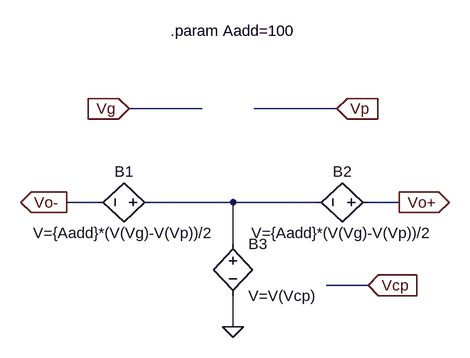
[diagram p0: schematic gain_boosting_pmos.asc]
gain_boosting_pmos.asc, the LTspice schematic file:
Version 4
SHEET 1 880 680
WIRE 128 48 16 48
WIRE 336 48 208 48
WIRE -32 192 -80 192
WIRE 176 192 48 192
WIRE 304 192 176 192
WIRE 432 192 384 192
WIRE 176 256 176 192
WIRE 384 320 320 320
WIRE 176 384 176 336
FLAG 176 384 0
FLAG 384 320 Vcp
IOPIN 384 320 In
FLAG 16 48 Vg
IOPIN 16 48 In
FLAG 336 48 Vp
IOPIN 336 48 In
FLAG -80 192 Vo-
IOPIN -80 192 Out
FLAG 432 192 Vo+
IOPIN 432 192 Out
DATAFLAG 272 48 "round($*1000)/1000"
DATAFLAG 80 48 "round($*1000)/1000"
DATAFLAG 128 192 "round($*1000)/1000"
DATAFLAG 400 192 "round($*1000)/1000"
DATAFLAG -64 192 "round($*1000)/1000"
SYMBOL bv 64 192 R90
WINDOW 0 -32 56 VBottom 2
WINDOW 3 32 56 VTop 2
SYMATTR InstName B1
SYMATTR Value V={Aadd}*(V(Vg)-V(Vp))/2
SYMBOL bv 400 192 R90
WINDOW 0 -32 56 VBottom 2
WINDOW 3 32 56 VTop 2
SYMATTR InstName B2
SYMATTR Value V={Aadd}*(V(Vg)-V(Vp))/2
SYMBOL bv 176 240 R0
SYMATTR InstName B3
SYMATTR Value V=V(Vcp)
TEXT 80 -72 Left 2 !.param Aadd=100

The netlist it stands for:
* gain_boosting_pmos.asc
B1 N001 Vo- V={Aadd}*(V(Vg)-V(Vp))/2
B2 Vo+ N001 V={Aadd}*(V(Vg)-V(Vp))/2
B3 N001 0 V=V(Vcp)
.param Aadd=100
.backanno
.end